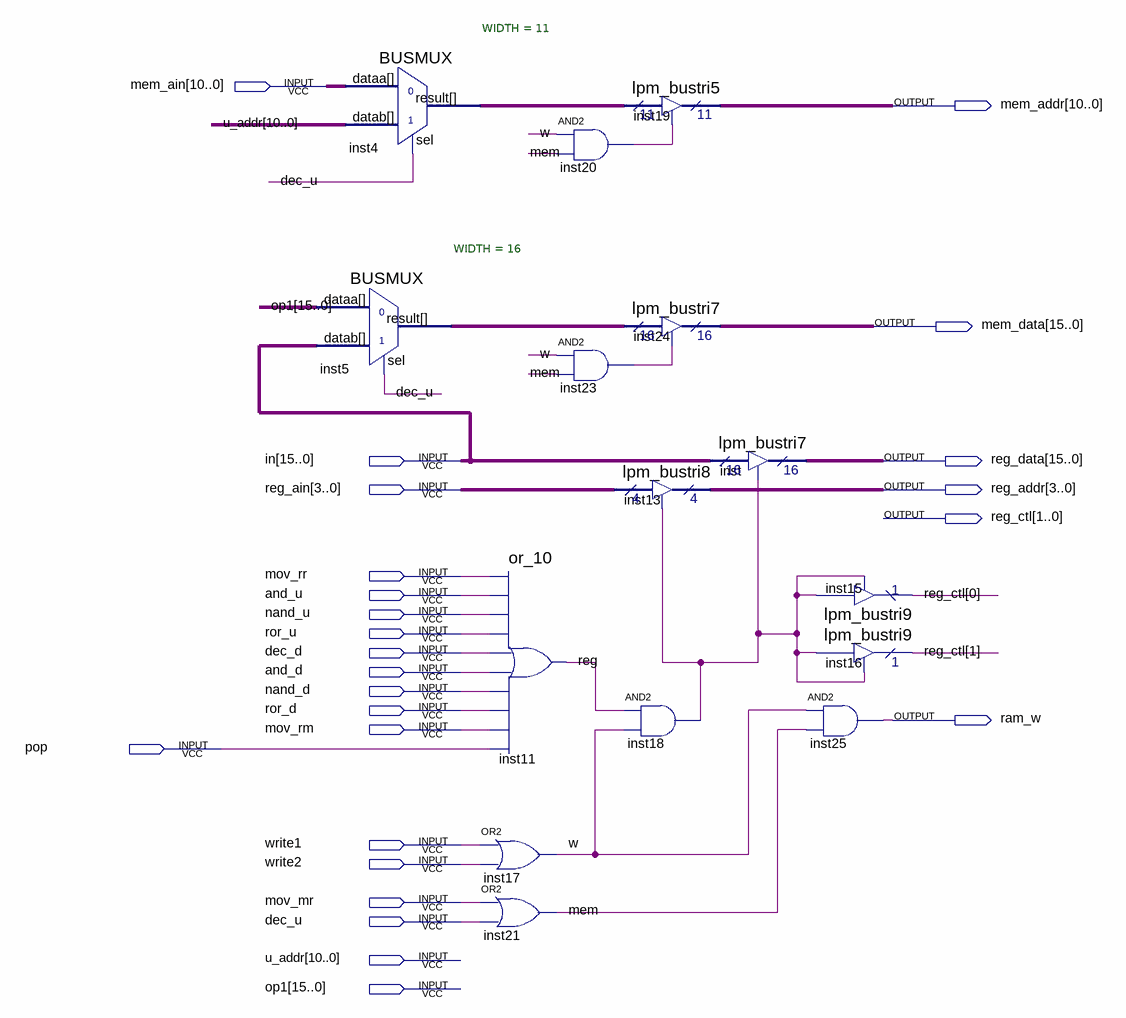
[diagram p0: schematic sheet]
// Quartus schematic w_res.bdf as structural Verilog: 15 symbols, 25 pins
module w_res (
  input  [10:0] mem_ain,
  input  [15:0] in,
  input  [3:0] reg_ain,
  input  mov_rr,
  input  and_u,
  input  nand_u,
  input  ror_u,
  input  dec_d,
  input  and_d,
  input  nand_d,
  input  ror_d,
  input  mov_rm,
  input  pop,
  input  write1,
  input  write2,
  input  mov_mr,
  input  dec_u,
  input  [10:0] u_addr,
  input  [15:0] op1,
  output [10:0] mem_addr,
  output [15:0] mem_data,
  output [15:0] reg_data,
  output [3:0] reg_addr,
  output [1:0] reg_ctl,
  output ram_w
);

  wire inst18_out, inst20_out, inst23_out, mem, \reg , w;
  wire [10:0] inst4_result;
  wire [15:0] inst5_result;

  BUSMUX #(.WIDTH(11)) inst4 (.datab(u_addr), .sel(dec_u), .dataa(mem_ain), .result(inst4_result));
  BUSMUX #(.WIDTH(16)) inst5 (.datab(in), .sel(dec_u), .dataa(op1), .result(inst5_result));
  or_10 inst11 (
    .data0(mov_rr), .data1(and_u), .data2(nand_u), .data3(ror_u), .data4(dec_d), .data5(and_d),
    .data6(nand_d), .data7(ror_d), .data8(mov_rm), .data9(pop), .result(\reg ));
  or inst17 (w, write1, write2);
  or inst21 (mem, mov_mr, dec_u);
  and inst20 (inst20_out, w, mem);
  and inst23 (inst23_out, w, mem);
  lpm_bustri5 inst19 (.enabledt(inst20_out), .data(inst4_result), .tridata(mem_addr));
  lpm_bustri7 inst24 (.enabledt(inst23_out), .data(inst5_result), .tridata(mem_data));
  lpm_bustri8 inst13 (.enabledt(inst18_out), .data(reg_ain), .tridata(reg_addr));
  and inst18 (inst18_out, \reg , w);
  lpm_bustri7 inst (.enabledt(inst18_out), .data(in), .tridata(reg_data));
  lpm_bustri9 inst15 (.enabledt(inst18_out), .data(inst18_out), .tridata(reg_ctl[0]));
  lpm_bustri9 inst16 (.enabledt(inst18_out), .data(inst18_out), .tridata(reg_ctl[1]));
  and inst25 (ram_w, w, mem);
endmodule
